# Altium schematic sheet Connecteur.SchDoc: drive_motor
size Letter; ApprovedBy: Himself; Author: Arthur Bou-Boinne; Organization: Cegep Limoilou; Address1: 1300, 8e Avenue; Address2: Québec, QC; Address3: Canada; Address4: G1J 5L5; SheetNumber: 2; SheetTotal: 4
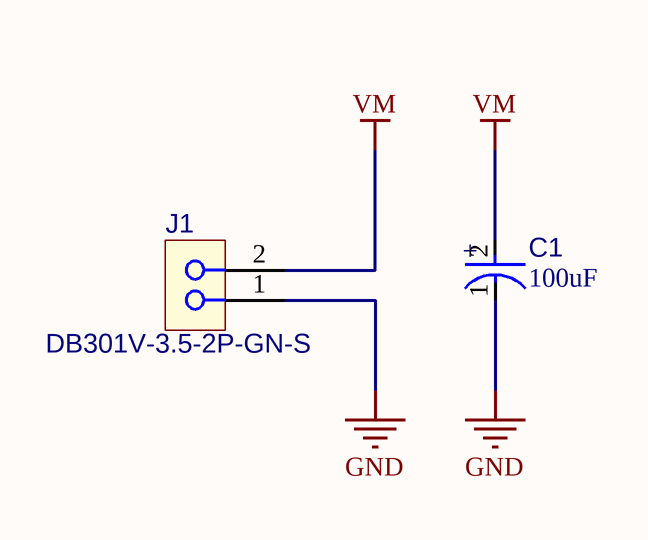
[diagram p0: Connecteur.SchDoc]

## Parts
C1  value 100uF  [C_EL_D10MM-L11MM]
J1  DB301V-3.5-2P-GN-S  [CONN_TERM_BLOCK_2POS_3mm5]

## Nets
GND: C1.1(C) J1.1
VM: C1.2(A) J1.2

## Notes on the sheet
- Titre :
- Conception :
- Date :
- Approbation :
- Heure :
- Révision :
- Feuille
- de
- Fichier :
- (in symbol capacitor_EL) +

## Library data of the parts
C1 = capacitor_EL: Capacitor type EL
J1 = CONN-3MM5-2POS-TERM-BLOCK: CONN TERM BLOCK 2POS 3.5mm pitch; Manufacturer 1: Dorabo; Supplier 1: LCSC; Supplier Part Number 1: C695629; Manufacturer Part Number 1: DB301V-3.5-2P-GN-S; Mounting Technology: TH